# Altium project DC_Stepper.PrjPcb
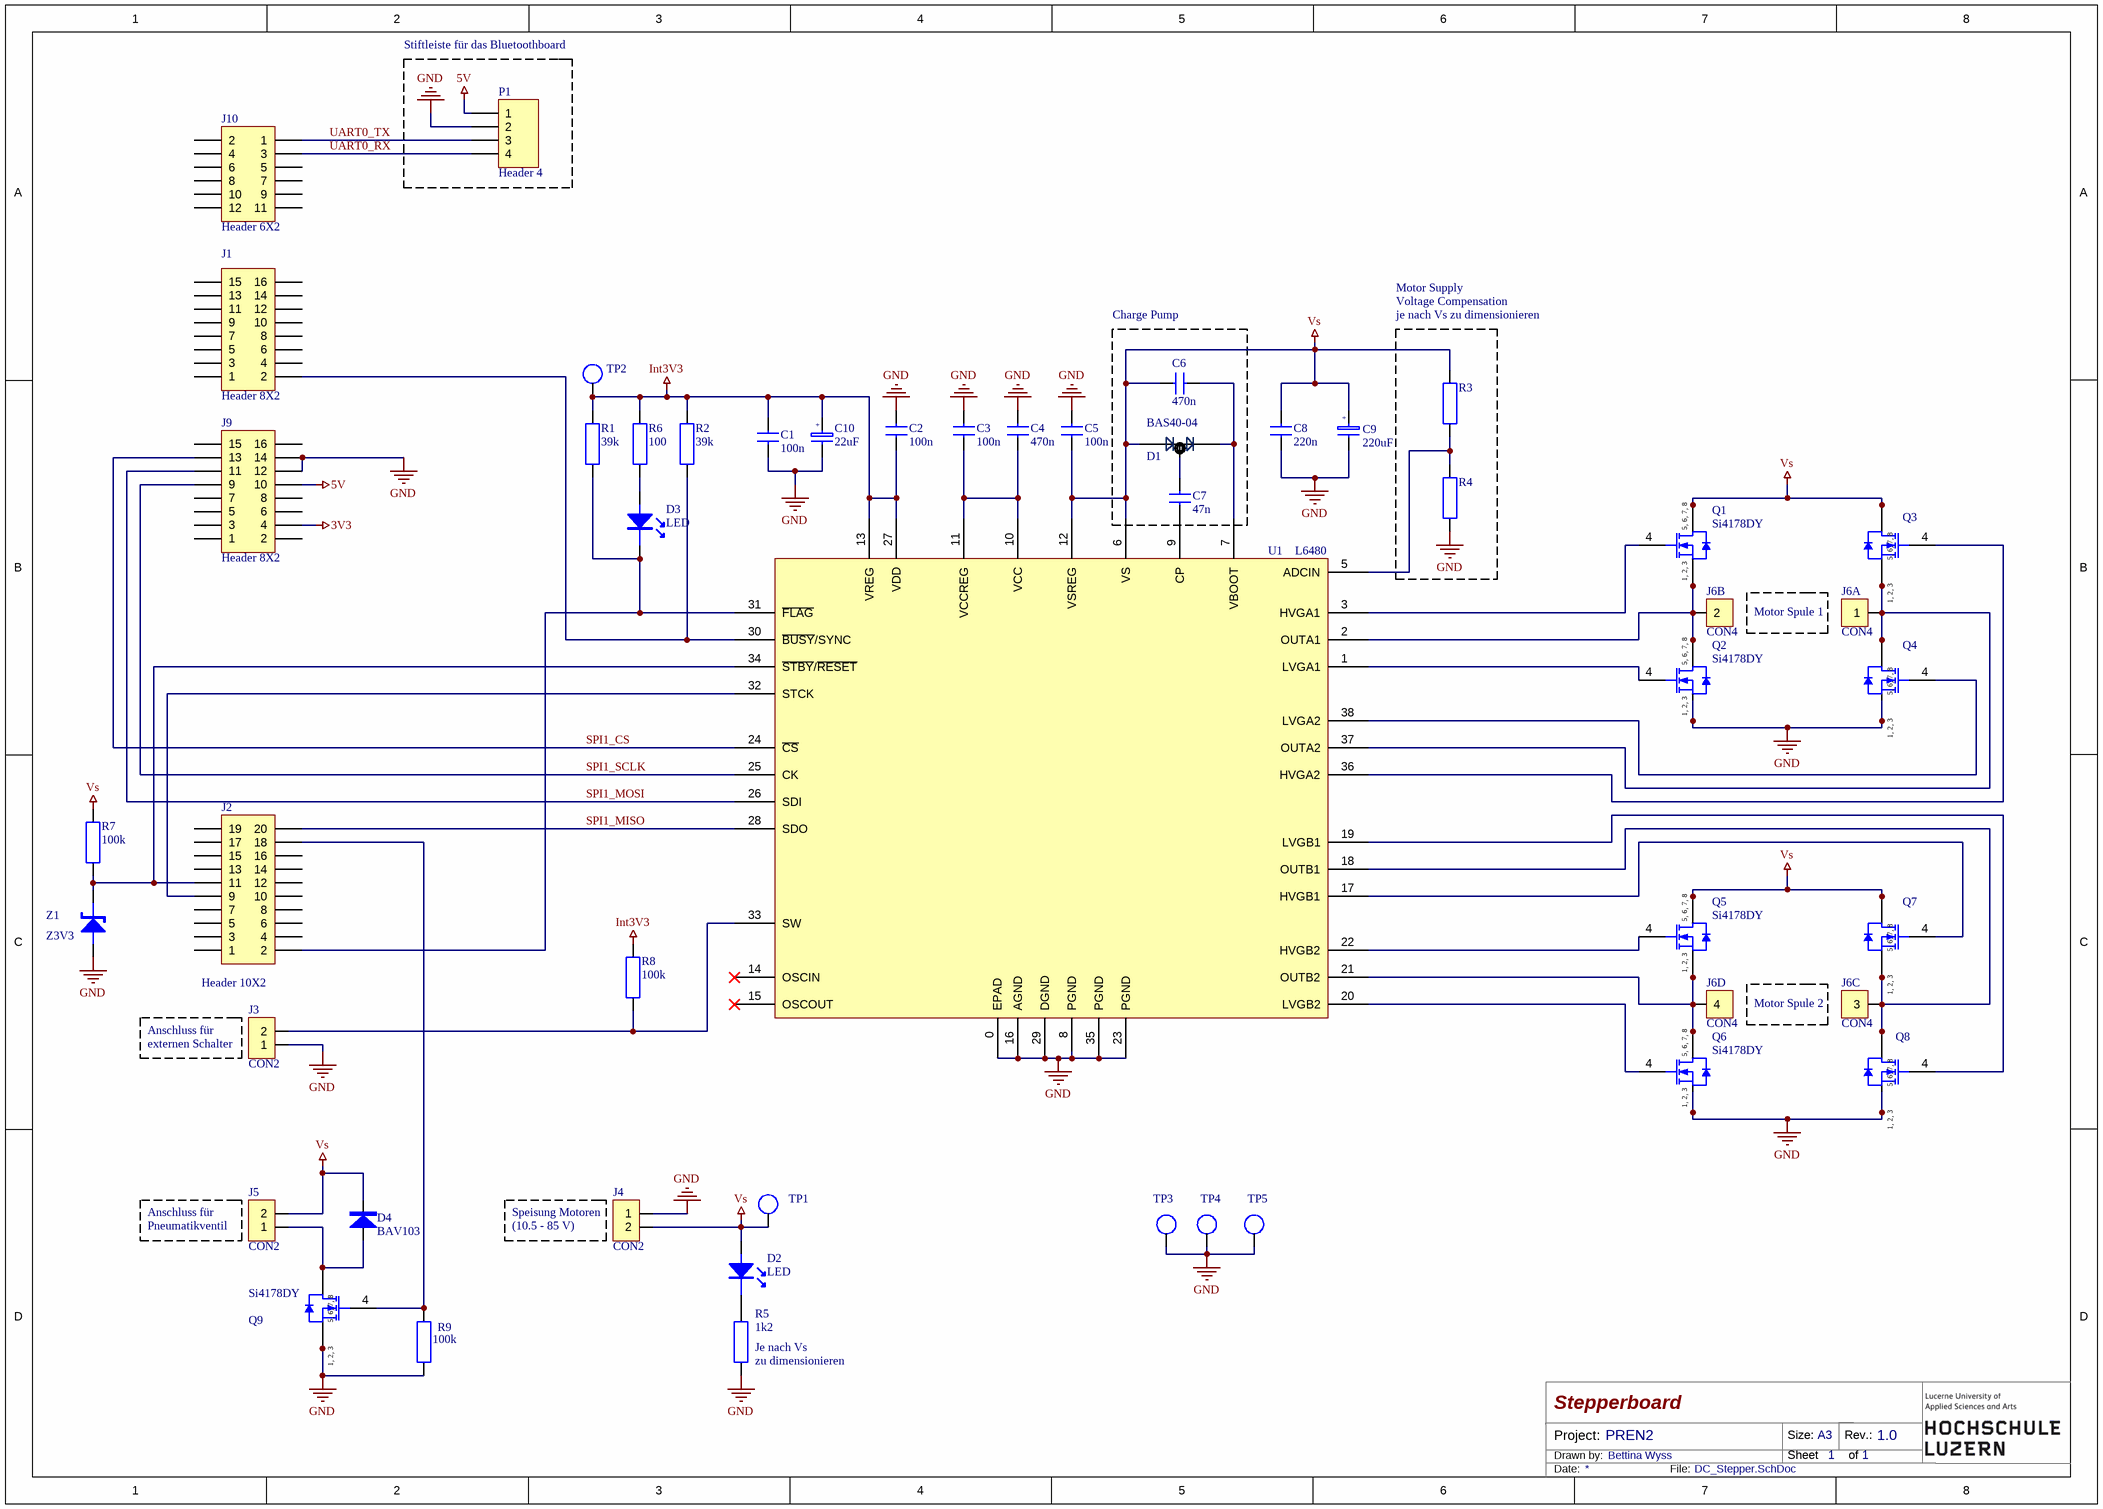
[diagram p0: DC_Stepper.SchDoc]
1 sheet, 48 parts. Net scope: global (net labels, ports and power ports of the same name join across sheets).
Board file: DC_Stepper.PcbDoc

## Sheet DC_Stepper.SchDoc: Stepperboard
size A3; DrawnBy: Bettina Wyss; Organization: HSLU T&A; Address1: Abteilung Elektrotechnik; Address2: Technikumsstrasse 21; Address3: CH-6048 Horw; Revision: 1.0; SheetNumber: 1; SheetTotal: 1; Projektname: PREN2

### Parts
C1  100n  [0805]
C2  100n  [0805]
C3  100n  [0805]
C4  470n  [0805]
C5  100n  [0805]
C6  470n  [0805]
C7  47n  [0805]
C8  220n  [0805]
C9  220uF  [ELKO_220uF]
C10  22uF  [ELKO_22uF]
D1  BAS40-04  [SOT-23 3L]
D2  LED  [LED]
D3  LED  [LED]
D4  BAV103  [SOD-80]
J1  Header 8X2  [HDR2X8]
J2  Header 10X2  [HDR2X10]
J3  CON2  [HEADER_1X2_3.81]
J4  CON2  [HEADER_1X2_3.81]
J5  CON2  [HEADER_1X2_3.81]
J6  CON4  [Header_1x4_3.81-H]  (parts A,B,C,D of 4)
J9  Header 8X2  [HDR2X8]
J10  Header 6X2  [HDR2X6]
P1  Header 4  [HDR1X4]
Q1  Si4178DY  [SO-8_N]
Q2  Si4178DY  [SO-8_N]
Q3  Si4178DY  [SO-8_N]  (value not drawn)
Q4  Si4178DY  [SO-8_N]  (value not drawn)
Q5  Si4178DY  [SO-8_N]
Q6  Si4178DY  [SO-8_N]
Q7  Si4178DY  [SO-8_N]  (value not drawn)
Q8  Si4178DY  [SO-8_N]  (value not drawn)
Q9  Si4178DY  [SO-8_N]
R1  39k  [0805]
R2  39k  [0805]
R3  27k  [0805]  (value not drawn)
R4  2k  [0805]  (value not drawn)
R5  1k2  [0805]
R6  100  [0805]
R7  100k  [0805]
R8  100k  [0805]
R9  100k  [0805]
TP1  TP  [TP2.54-1.0]  (value not drawn)
TP2  TP  [TP2.54-1.0]  (value not drawn)
TP3  TP  [TP2.54-1.0]  (value not drawn)
TP4  TP  [TP2.54-1.0]  (value not drawn)
TP5  TP  [TP2.54-1.0]  (value not drawn)
U1  L6480  [HTSSOP38]
Z1  Z3V3  [LED]

### Blocks framed on the sheet
Charge Pump: C6 C7 D1
je nach Vs zu dimensionieren: R3 R4

### Nets
3V3: J9.4
5V: J9.10 P1.1
GND: C1.2 C2.2 C3.2 C4.2 C5.2 C8.1 C9.K C10.K J3.1 J4.1 J9.12 J9.14 P1.2 Q2.1(S) Q2.2(S) Q2.3(S) Q4.1(S) Q4.2(S) Q4.3(S) Q6.1(S) Q6.2(S) Q6.3(S) Q8.1(S) Q8.2(S) Q8.3(S) Q9.1(S) Q9.2(S) Q9.3(S) R4.1 R5.1 R9.1 TP3.1 TP4.1 TP5.1 U1.0(EPAD) U1.8(PGND) U1.16(AGND) U1.23(PGND) U1.29(DGND) U1.35(PGND) Z1.A
Int3V3: C1.1 C2.1 C10.A R1.2 R2.2 R6.2 R8.2 TP2.1 U1.13(VREG) U1.27(VDD)
Vs: C5.1 C6.2 C8.2 C9.A D1.1 D2.A D4.K J4.2 J5.2 Q1.5(D) Q1.6(D) Q1.7(D) Q1.8(D) Q3.5(D) Q3.6(D) Q3.7(D) Q3.8(D) Q5.5(D) Q5.6(D) Q5.7(D) Q5.8(D) Q7.5(D) Q7.6(D) Q7.7(D) Q7.8(D) R3.2 R7.2 TP1.1 U1.6(VS) U1.12(VSREG)
SPI1_CS: J9.13 U1.24(~{CS})
SPI1_MISO: J2.20 U1.28(SDO)
SPI1_MOSI: J9.11 U1.26(SDI)
SPI1_SCLK: J9.9 U1.25(CK)
UART0_RX: J10.3 P1.4
UART0_TX: J10.1 P1.3
NetC3_1: C3.1 C4.1 U1.10(VCC) U1.11(VCCREG)
NetC6_1: C6.1 D1.2 U1.7(VBOOT)
NetC7_1: C7.1 U1.9(CP)
NetC7_2: C7.2 D1.3
NetD2_K: D2.K R5.2
NetD3_A: D3.A R6.1
NetD3_K: D3.K J2.2 R1.1 U1.31(~{FLAG})
NetD4_A: D4.A J5.1 Q9.5(D) Q9.6(D) Q9.7(D) Q9.8(D)
NetJ1_2: J1.2 R2.1 U1.30(~{BUSY}/SYNC)
NetJ2_9: J2.9 U1.32(STCK)
NetJ2_11: J2.11 R7.1 U1.34(~{STBY}/~{RESET}) Z1.K
NetJ2_18: J2.18 Q9.4(G) R9.2
NetJ3_2: J3.2 R8.1 U1.33(SW)
NetJ6_1: J6.1 Q3.1(S) Q3.2(S) Q3.3(S) Q4.5(D) Q4.6(D) Q4.7(D) Q4.8(D) U1.37(OUTA2)
NetJ6_2: J6.2 Q1.1(S) Q1.2(S) Q1.3(S) Q2.5(D) Q2.6(D) Q2.7(D) Q2.8(D) U1.2(OUTA1)
NetJ6_3: J6.3 Q7.1(S) Q7.2(S) Q7.3(S) Q8.5(D) Q8.6(D) Q8.7(D) Q8.8(D) U1.18(OUTB1)
NetJ6_4: J6.4 Q5.1(S) Q5.2(S) Q5.3(S) Q6.5(D) Q6.6(D) Q6.7(D) Q6.8(D) U1.21(OUTB2)
NetQ1_4: Q1.4(G) U1.3(HVGA1)
NetQ2_4: Q2.4(G) U1.1(LVGA1)
NetQ3_4: Q3.4(G) U1.36(HVGA2)
NetQ4_4: Q4.4(G) U1.38(LVGA2)
NetQ5_4: Q5.4(G) U1.22(HVGB2)
NetQ6_4: Q6.4(G) U1.20(LVGB2)
NetQ7_4: Q7.4(G) U1.17(HVGB1)
NetQ8_4: Q8.4(G) U1.19(LVGB1)
NetR3_1: R3.1 R4.2 U1.5(ADCIN)

Not connected (* = marked no-connect by the designer): J1 1 3 4 5 6 7 8 9 10 11 12 13 14 15 16; J2 1 3 4 5 6 7 8 10 12 13 14 15 16 17 19; J9 1 2 3 5 6 7 8 15 16; J10 2 4 5 6 7 8 9 10 11 12; U1 4(NC) 14(OSCIN)* 15(OSCOUT)*

### Notes on the sheet
- Stiftleiste für das Bluetoothboard
- Motor Supply
- Voltage Compensation
- (near J6) Motor Spule 1
- Anschluss für
- (near J3) externen Schalter
- (near J6) Motor Spule 2
- (near J5) Anschluss für
- (near J5) Pneumatikventil
- (near J4) Speisung Motoren
- (near J4) (10.5 - 85 V)
- (near R5) Je nach Vs
- (near R5) zu dimensionieren
- Project:
- Drawn by:
- Size:
- Sheet
- A3
- Rev.:
- of
- Date:
- File:
- (in symbol C? ELKO) +
- (in symbol ELKO_22uF) +
- (in symbol SI4412DY) 5, 6, 7, 8; 1, 2, 3

### Library data of the parts
C1-C8 = C?: Normaler Kondensator
C9 = C? ELKO: Elektrolyt /polarisierter Kondensator
C10 = ELKO_22uF
D1 = BAV99
D4 = D?: Diode
J1 J9 = Header 8X2: Header, 8-Pin, Dual row; LatestRevisionDate: 17-Jul-2002; LatestRevisionNote: Re-released for DXP Platform.; Publisher: Altium Limited
J2 = Header 10X2: Header, 10-Pin, Dual row; LatestRevisionDate: 17-Jul-2002; LatestRevisionNote: Re-released for DXP Platform.; Publisher: Altium Limited
J6 = HEADER_4: 1x4_3.81-H
J10 = Header 6X2: Header, 6-Pin, Dual row; LatestRevisionDate: 17-Jul-2002; LatestRevisionNote: Re-released for DXP Platform.; Publisher: Altium Limited
P1 = Header 4: Header, 4-Pin; LatestRevisionDate: 17-Jul-2002; LatestRevisionNote: Re-released for DXP Platform.; Publisher: Altium Limited
Q1-Q9 = SI4412DY: N-Channel 30V (D-S)  Rated MOSFET; Published: 8-Jun-2000; LatestRevisionDate: 13-Apr-2006; LatestRevisionNote: IPC-7351 Footprint Added.; DatasheetVersion: 6-Oct-1997; PackageVersion: Aug-1998; PackageReference: SO-8; Publisher: Altium Limited; PackageDescription: 8-Pin Small Outline Integrated Circuit 1.27 mm Pitch; ComponentLink1Description: Manufacturer Link; ComponentLink1URL: http://www.vishay.com/; ComponentLink2Description: Datasheet; ComponentLink2URL: http://www.vishay.com/docs/70154/70154.pdf
R1-R9 = R?: Normaler Widerstand
Z1 = ZENER2